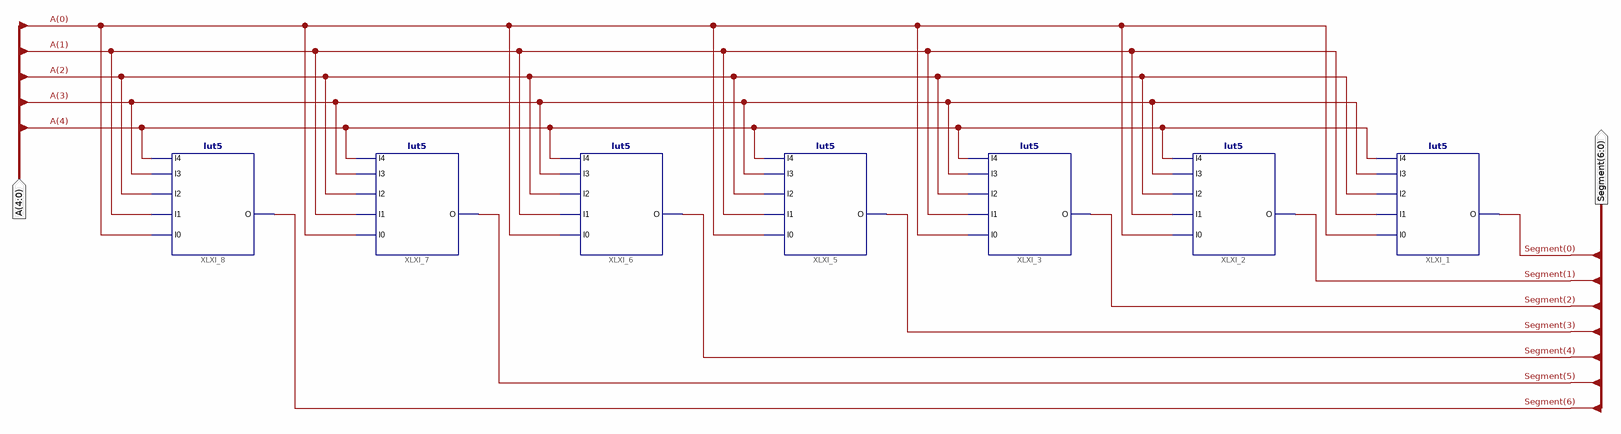
[diagram p0: schematic sheet 1]
// Xilinx ISE schematic ssd1d_aztb.sch (spartan6) as structural Verilog: 7 symbols, 2 ports
module ssd1d_aztb (
  input  [4:0] A,
  output [6:0] Segment
);

  lut5 #(.INIT("071B09F6")) XLXI_8 (.I0(A[0]), .I1(A[1]), .I2(A[2]), .I3(A[3]), .O(Segment[6]), .I4(A[4]));
  lut5 #(.INIT("02BFD9EE")) XLXI_7 (.I0(A[0]), .I1(A[1]), .I2(A[2]), .I3(A[3]), .O(Segment[5]), .I4(A[4]));
  lut5 #(.INIT("0475F97E")) XLXI_6 (.I0(A[0]), .I1(A[1]), .I2(A[2]), .I3(A[3]), .O(Segment[4]), .I4(A[4]));
  lut5 #(.INIT("06F894BC")) XLXI_5 (.I0(A[0]), .I1(A[1]), .I2(A[2]), .I3(A[3]), .O(Segment[3]), .I4(A[4]));
  lut5 #(.INIT("036AE796")) XLXI_3 (.I0(A[0]), .I1(A[1]), .I2(A[2]), .I3(A[3]), .O(Segment[2]), .I4(A[4]));
  lut5 #(.INIT("07A3C792")) XLXI_2 (.I0(A[0]), .I1(A[1]), .I2(A[2]), .I3(A[3]), .O(Segment[1]), .I4(A[4]));
  lut5 #(.INIT("040FE0EA")) XLXI_1 (.I0(A[0]), .I1(A[1]), .I2(A[2]), .I3(A[3]), .O(Segment[0]), .I4(A[4]));
endmodule
